# EAGLE design AST1004 (EAGLE 6.3)
DATABASE: ./../../../../../Components/TinyCircuits_Part_Database.txt
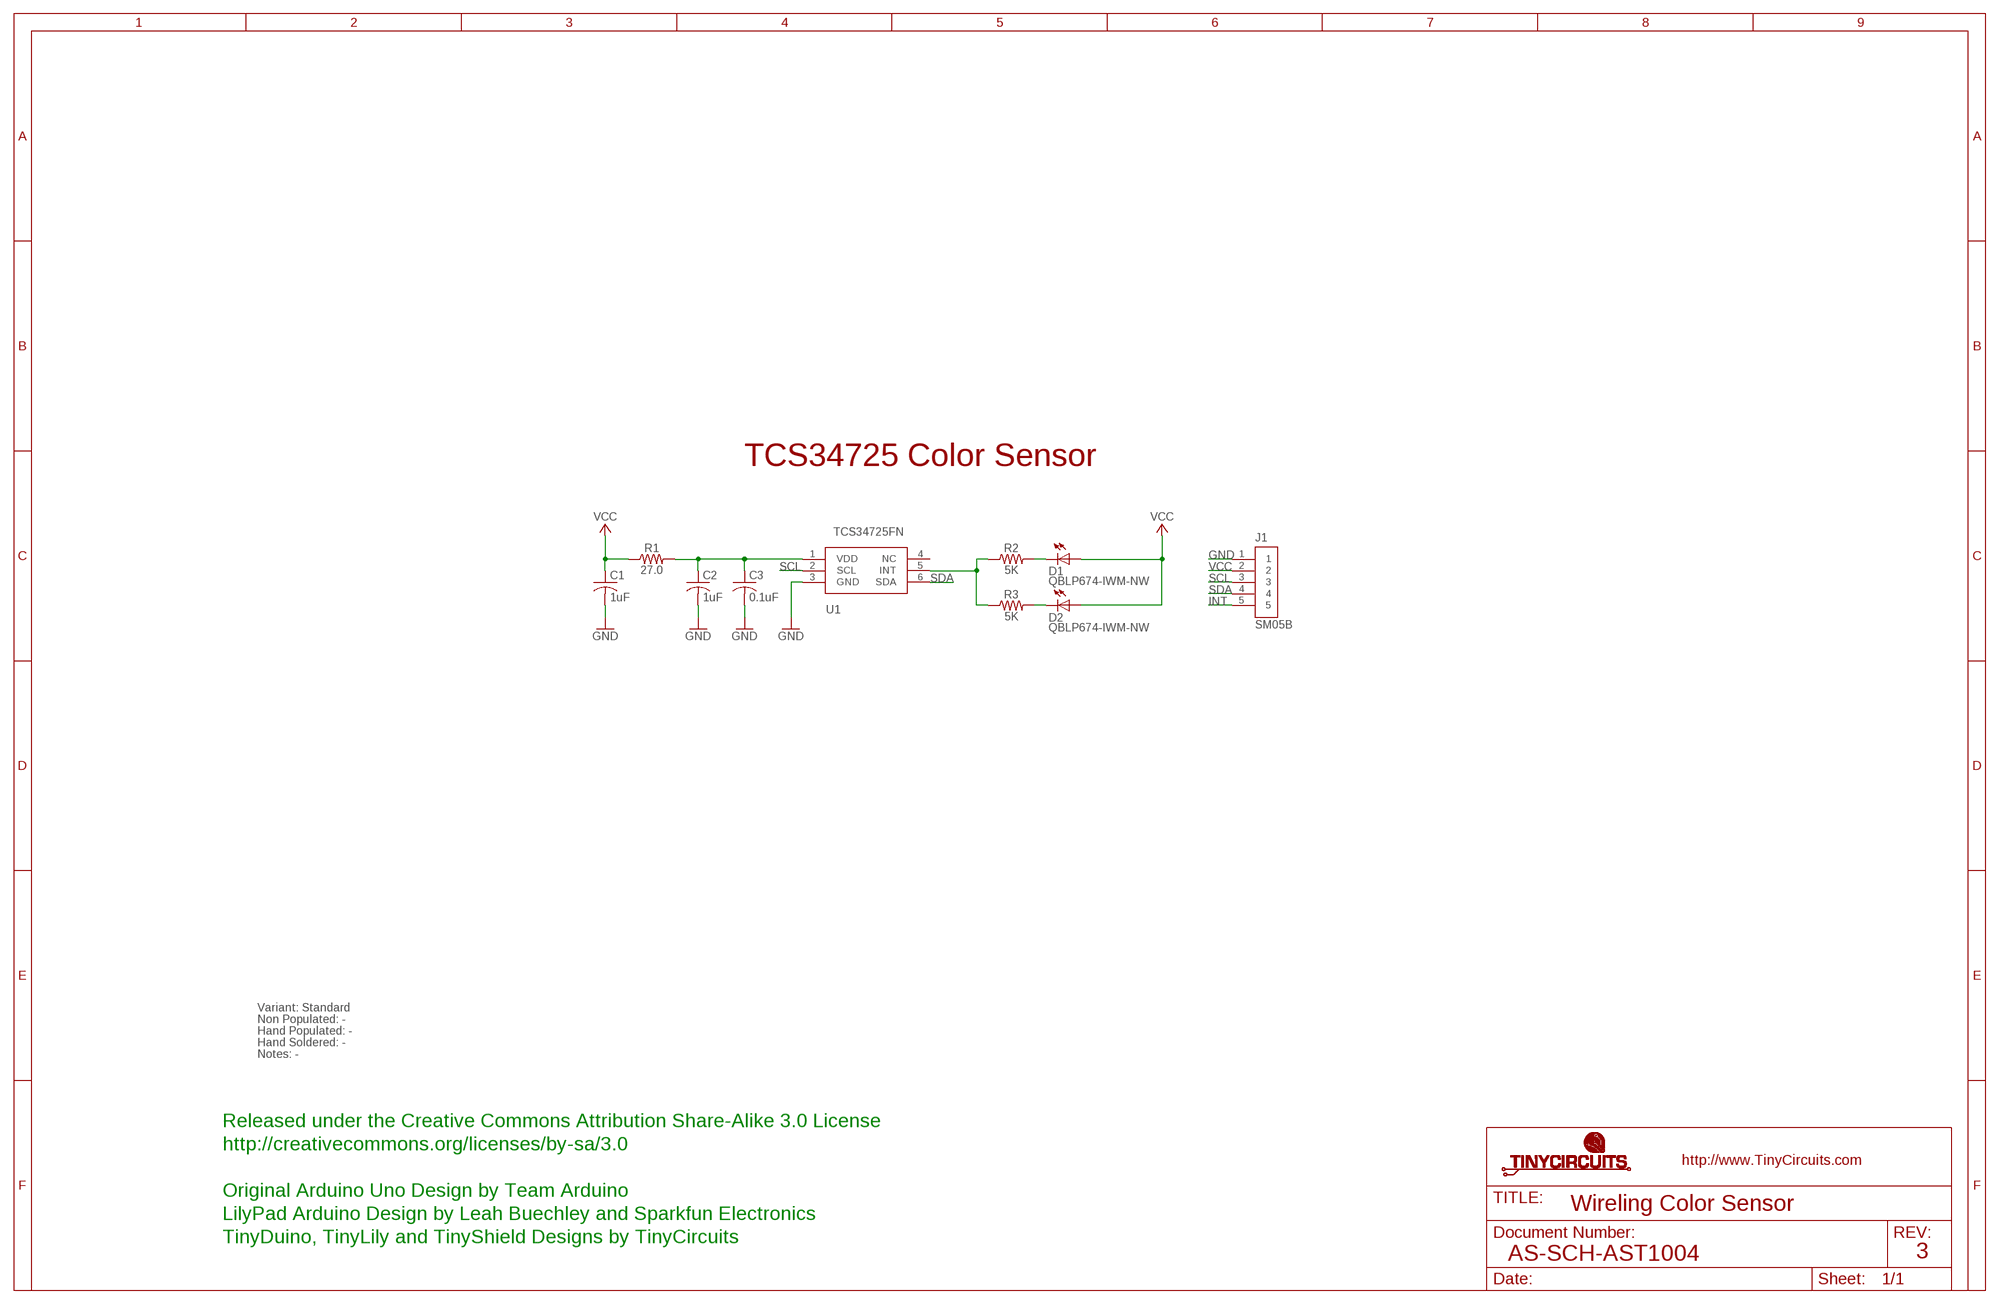
[diagram p0: schematic, sheet 1]

## Parts
C1  1uF  AS-ITM-00105  [C0402]
C2  1uF  AS-ITM-00105  [C0402]
C3  0.1uF  AS-ITM-00008  [C0402]
D1  QBLP674-IWM-NW  AS-ITM-00554  [LED_TOP_2.8X1.4]
D2  QBLP674-IWM-NW  AS-ITM-00554  [LED_TOP_2.8X1.4]
J1  SM05B  AS-ITM-00340EDGE  [JST_SH_5X1_EDGE]
R1  27.0  AS-ITM-00240  [0402]
R2  5K  AS-ITM-00289  [0402]
R3  5K  AS-ITM-00289  [0402]
U1  TCS34725FN  AS-ITM-00140  [TSL2572]

## Nets
GND: C1.2 C2.2 C3.2 J1.1 U1.3(GND)
INT: J1.5
N$1: R2.1 R3.1 U1.5(INT)
N$2: C2.1 C3.1 R1.2 U1.1(VDD)
N$3: D2.C R3.2
N$4: D1.C R2.2
SCL: J1.3 U1.2(SCL)
SDA: J1.4 U1.6(SDA)
VCC: C1.1 D1.A D2.A J1.2 R1.1
Unconnected: U1.4(NC)

## Notes on the sheet
- TCS34725 Color Sensor
- Variant: Standard
- Non Populated: -
- Hand Populated: -
- Hand Soldered: -
- Notes: -
- Released under the Creative Commons Attribution Share-Alike 3.0 License
- http://creativecommons.org/licenses/by-sa/3.0
- Original Arduino Uno Design by Team Arduino
- Wireling Color Sensor
- LilyPad Arduino Design by Leah Buechley and Sparkfun Electronics
- TinyDuino, TinyLily and TinyShield Designs by TinyCircuits
- AS-SCH-AST1004 | 3

## Library data of the parts
C1 C2 = tinycircuits:AS-ITM-00105: CAP CER 1UF 6.3V 10% X5R 0402; PARTNO: AS-ITM-00105
C3 = tinycircuits:AS-ITM-00008: CAP CER 0.1UF 16V 10% X5R 0402; PARTNO: AS-ITM-00008
D1 D2 = tinycircuits:AS-ITM-00554: LED WHITE 2PLCC SMD; PARTNO: AS-ITM-00554
J1 = tinycircuits:AS-ITM-00340: CONN HEADER SH 5POS SIDE 1MM TIN; PARTNO: AS-ITM-00340; PNPROTATION: 180
R1 = tinycircuits:AS-ITM-00240: RES 27 OHM 1/16W 5% 0402 SMD; PARTNO: AS-ITM-00240
R2 R3 = tinycircuits:AS-ITM-00289: RES SMD 5.0K OHM 1% 1/16W 0402; PARTNO: AS-ITM-00289
U1 = tinycircuits:AS-ITM-00140: TCS3472 Color Sensor; PARTNO: AS-ITM-00140

## Net classes
2 gnd: width 0.305 mm, drill 0.559 mm, clearance 0.254 mm

## Board
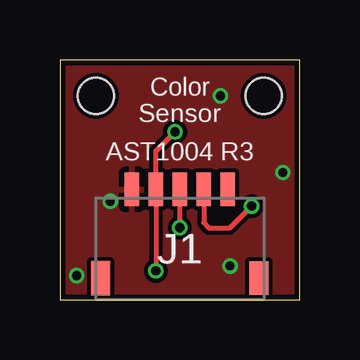
[diagram p1: board, top side]
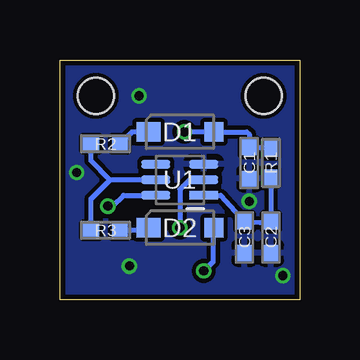
[diagram p2: board, bottom side, seen from below]

Size 10 x 10 mm. Coordinates in mm from the lower left corner, seen from the top.
Outline: 0,0 10,0 10,10 0,10 0,0
Copper layers (1*16): Top 0.035mm / dielectric 1.5mm / Bottom 0.035mm
Design rules "default *": minimum track width 8mil, minimum drill 15mil, track to track 7mil, track to pad 7mil, pad to pad 7mil, via to via 7mil, smd to smd 7mil, copper to edge 8mil, drill to drill 8mil, minimum pad ring 8mil, minimum via ring 5mil, stop-mask expansion 4mil, vias tented up to drill 25mil, thermal gap 10mil
Holes 1.5 mm at 1.5,8.5 8.5,8.5

### Footprints (pad centres in the part's own frame; a part is rotated, then mirrored left to right if it is on the bottom)
C0402 = smd 0.65 x 0.6: 1 -0.65,0; 2 0.65,0
LED_TOP_2.8X1.4 = smd 0.8 x 0.8: A 1.422,0 | smd 1 x 0.8: C -1.3,0
JST_SH_5X1_EDGE = smd 0.6 x 1.4: 1 -2,2.475; 2 -1,2.475; 3 0,2.475; 4 1,2.475; 5 2,2.475 | smd 0.8 x 1.4: PAD1 -3.3,-1.225; PAD2 3.3,-1.225
0402 = smd 0.65 x 0.55: 1 -0.6,0; 2 0.6,0
TSL2572 = smd 1.2 x 0.35: 1 -1,0.65; 2 -1,0; 3 -1,-0.65; 4 1,-0.65; 5 1,0; 6 1,0.65

### Placement (x,y rotation side)
C1  2.1,5.7 270 bottom
C2  1.2,2.6 270 bottom
C3  2.3,2.6 270 bottom
D1  5,7 0 bottom
D2  5,3 0 bottom
J1  5,2.12 0 top
R1  1.2,5.7 270 bottom
R2  8.1,6.5 0 bottom
R3  8.1,2.9 0 bottom
U1  5,5 180 bottom
U$1  [DOCFIELD-TINYCIRCUITS-PCB]  19,-10 0 top  (outside the outline)

### Tracks (layer width: path | path; a pad name or v marks a point on that pad's centre or on a via)
GND  (via drill 0.38)
  other vias: 7.1,1.4 0.7,1 9.3,5.3 2.1,4.1 6.7,8.5
  pour Bottom: 0,10 10,10 10,0 0,0
  pour Top: 0,10 10,10 10,0 0,0
N$1
  Bottom 0.203: U1.5 7.9,5 | 7.9,5 8.7,5.8 R2.1 | R3.1 8.7,4.2 7.9,5
N$2
  Bottom 0.203: U1.1 3.3,4.35 C3.1 1.65,3.2 C2.1 R1.2
N$3
  Bottom 0.203: R3.2 6.4,2.9 D2.C
N$4
  Bottom 0.203: D1.C 7,7 R2.2
SCL  (via drill 0.38)
  Top 0.203: v5,3 J1.3
  Bottom 0.203: U1.2 4.6,5 J1.3 v5,3
SDA  (via drill 0.38)
  Top 0.203: J1.4 6,3.2 6.2,3 7.1,3 v8,3.9
  Bottom 0.203: v8,3.9 7.8,3.9 7.35,4.35 U1.6
VCC  (via drill 0.38)
  Top 0.203: v4,1.2 J1.2 4,6.2 v4.8,7
  Bottom 0.203: 1.3,6.3 R1.1 1.25,6.35 C1.1 2.1,6.9 2.2,7 D1.A v4.8,7 | v4,1.2 3.6,1.6 3.6,2.98 D2.A

### Text on the board
tPlace: Color | Sensor | AST1004 R3
Document: FABRICATION DRAWING | NOTES: | 1. PRINTED CIRCUIT BOARD MADE FROM NEMA GRADE FR-4 EPOXY LAMINATE | WITH 1 OUNCE COPPER PLATING AND .024 THICKNESS. | 2. ALL DIMENSIONS ARE GIVEN IN MILLIMETERS. | 3. CIRCUIT PATHS ARE FOR REFERENCE ONLY. | 4. HOLE SIZES SHOWN ARE FINISHED DIAMETERS AFTER PLATING. | 5. BOARD PLATED USING REFLOW OR SIMILAR METHOD. | 6. BOARD TO HAVE BLUE SOLDER MASK ON PLATED SURFACES USING WET FILM | 7. SILKSCREEN BOARD USING WHITE INK. | SR100 OR SR1010 EPOXY. EQUIVALENT WET OR DRY FILM MAY BE USED. | 8. THE FOLLOWING INFORMATION APPLIES TO THIS BOARD: | * 2 COPPER LAYERS | * .024 BOARD THICKNESS | * REQUIRES TOP SIDE SILKSCREEN | Released under the Creative Commons Attribution Share-Alike 3.0 License | http://creativecommons.org/licenses/by-sa/3.0 | Original Arduino Uno Design by Team Arduino | LilyPad Arduino Design by Leah Buechley and Sparkfun Electronics | TinyDuino, TinyLily and TinyShield Designs by TinyCircuits | Wireling Color Sensor | AS-PCB-AST1004 | 3